# EAGLE design vca (EAGLE 9.5.2)
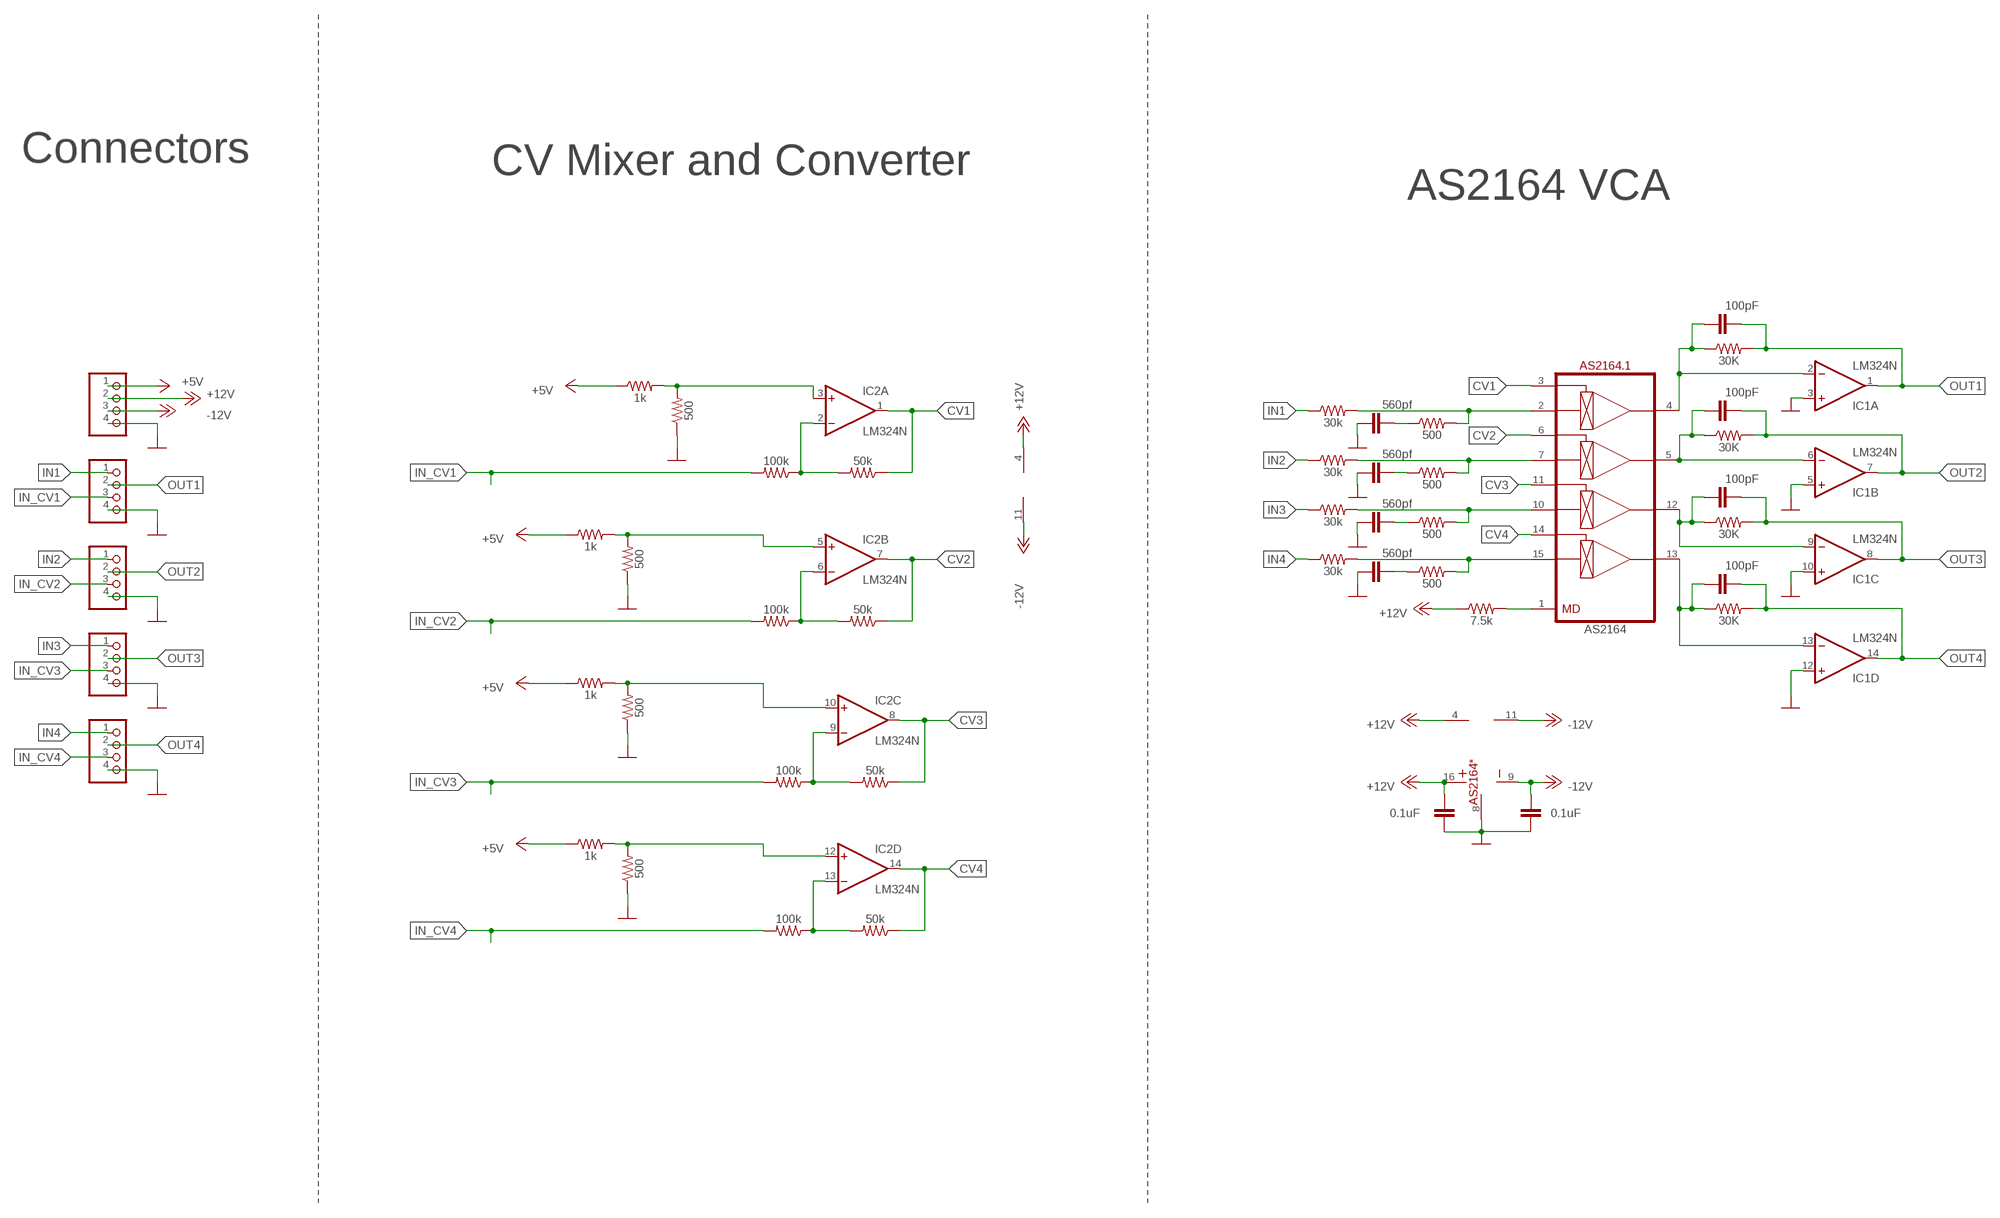
[diagram p0: schematic, sheet 1]

## Parts
AS2164  AS2164  V2164D  [DIP-16]
C1  560pf  0.1UF-KIT-EZ-50V-20%  [CAP-PTH-SMALL-KIT]
C2  560pf  0.1UF-KIT-EZ-50V-20%  [CAP-PTH-SMALL-KIT]
C3  560pf  0.1UF-KIT-EZ-50V-20%  [CAP-PTH-SMALL-KIT]
C4  560pf  0.1UF-KIT-EZ-50V-20%  [CAP-PTH-SMALL-KIT]
C5  0.1uF  0.1UF-KIT-EZ-50V-20%  [CAP-PTH-SMALL-KIT]
C6  0.1uF  0.1UF-KIT-EZ-50V-20%  [CAP-PTH-SMALL-KIT]
C7  100pF  0.1UF-KIT-EZ-50V-20%  [CAP-PTH-SMALL-KIT]
C8  100pF  0.1UF-KIT-EZ-50V-20%  [CAP-PTH-SMALL-KIT]
C9  100pF  0.1UF-KIT-EZ-50V-20%  [CAP-PTH-SMALL-KIT]
C10  100pF  0.1UF-KIT-EZ-50V-20%  [CAP-PTH-SMALL-KIT]
IC1  LM324N  [DIL14]
IC2  LM324N  [DIL14]
JP1  PINHD-1X4  [1X04]
JP5  PINHD-1X4  [1X04]
JP6  PINHD-1X4  [1X04]
JP7  PINHD-1X4  [1X04]
JP8  PINHD-1X4  [1X04]
R1  30k  RESISTORAXIAL-0.3  [AXIAL-0.3]
R2  30k  RESISTORAXIAL-0.3  [AXIAL-0.3]
R3  30k  RESISTORAXIAL-0.3  [AXIAL-0.3]
R4  500  RESISTORAXIAL-0.3  [AXIAL-0.3]
R5  30k  RESISTORAXIAL-0.3  [AXIAL-0.3]
R6  500  RESISTORAXIAL-0.3  [AXIAL-0.3]
R7  500  RESISTORAXIAL-0.3  [AXIAL-0.3]
R8  500  RESISTORAXIAL-0.3  [AXIAL-0.3]
R9  500  RESISTORAXIAL-0.3  [AXIAL-0.3]
R10  1k  RESISTORAXIAL-0.3  [AXIAL-0.3]
R11  100k  RESISTORAXIAL-0.3  [AXIAL-0.3]
R12  50k  RESISTORAXIAL-0.3  [AXIAL-0.3]
R13  1k  RESISTORAXIAL-0.3  [AXIAL-0.3]
R14  500  RESISTORAXIAL-0.3  [AXIAL-0.3]
R15  100k  RESISTORAXIAL-0.3  [AXIAL-0.3]
R16  50k  RESISTORAXIAL-0.3  [AXIAL-0.3]
R17  1k  RESISTORAXIAL-0.3  [AXIAL-0.3]
R18  500  RESISTORAXIAL-0.3  [AXIAL-0.3]
R19  100k  RESISTORAXIAL-0.3  [AXIAL-0.3]
R20  50k  RESISTORAXIAL-0.3  [AXIAL-0.3]
R21  1k  RESISTORAXIAL-0.3  [AXIAL-0.3]
R22  500  RESISTORAXIAL-0.3  [AXIAL-0.3]
R23  100k  RESISTORAXIAL-0.3  [AXIAL-0.3]
R24  50k  RESISTORAXIAL-0.3  [AXIAL-0.3]
R25  7.5k  RESISTORAXIAL-0.3  [AXIAL-0.3]
R26  30K  RESISTORAXIAL-0.3  [AXIAL-0.3]
R27  30K  RESISTORAXIAL-0.3  [AXIAL-0.3]
R28  30K  RESISTORAXIAL-0.3  [AXIAL-0.3]
R29  30K  RESISTORAXIAL-0.3  [AXIAL-0.3]

## Nets
+5V: JP6.1 R10.P$1 R13.P$1 R17.P$1 R21.P$1
+12V: AS2164.16(*:V+) C5.2 IC1.4(P:V+) IC2.4(P:V+) JP6.2 R25.P$1
-12V: AS2164.9(*:V-) C6.2 IC1.11(P:V-) IC2.11(P:V-) JP6.3
CV1: AS2164.3(.1:CV1) IC2.1(A:OUT) R20.P$1
CV2: AS2164.6(.1:CV2) IC2.7(B:OUT) R16.P$1
CV3: AS2164.11(.1:CV3) IC2.8(C:OUT) R12.P$1
CV4: AS2164.14(.1:CV4) IC2.14(D:OUT) R24.P$1
GND: AS2164.8(*:GND) C1.1 C2.1 C3.1 C4.1 C5.1 C6.1 IC1.3(A:+IN) IC1.5(B:+IN) IC1.10(C:+IN) IC1.12(D:+IN) JP1.4 JP5.4 JP6.4 JP7.4 JP8.4 R9.P$1 R14.P$1 R18.P$1 R22.P$1
IN1: JP5.1 R1.P$1
IN2: JP7.1 R2.P$1
IN3: JP1.1 R3.P$1
IN4: JP8.1 R5.P$1
IN_CV1: JP5.3 R19.P$2
IN_CV2: JP7.3 R15.P$2
IN_CV3: JP1.3 R11.P$2
IN_CV4: JP8.3 R23.P$2
N$1: AS2164.2(.1:IN1) R1.P$2 R8.P$2
N$2: AS2164.7(.1:IN2) R2.P$2 R7.P$2
N$3: AS2164.10(.1:IN3) R3.P$2 R6.P$2
N$4: AS2164.15(.1:IN4) R4.P$2 R5.P$2
N$5: C1.2 R8.P$1
N$6: C2.2 R7.P$1
N$7: C3.2 R6.P$1
N$8: C4.2 R4.P$1
N$9: IC2.5(B:+IN) R13.P$2 R14.P$2
N$10: IC2.3(A:+IN) R9.P$2 R10.P$2
N$11: IC2.9(C:-IN) R11.P$1 R12.P$2
N$12: IC2.10(C:+IN) R17.P$2 R18.P$2
N$13: IC2.12(D:+IN) R21.P$2 R22.P$2
N$14: IC2.6(B:-IN) R15.P$1 R16.P$2
N$17: IC2.2(A:-IN) R19.P$1 R20.P$2
N$20: IC2.13(D:-IN) R23.P$1 R24.P$2
N$21: AS2164.1(.1:MD) R25.P$2
N$25: AS2164.13(.1:OUT4) C7.1 IC1.13(D:-IN) R26.P$1
N$31: AS2164.12(.1:OUT3) C8.1 IC1.9(C:-IN) R27.P$1
N$32: AS2164.5(.1:OUT2) C9.1 IC1.6(B:-IN) R28.P$1
N$33: AS2164.4(.1:OUT1) C10.1 IC1.2(A:-IN) R29.P$1
OUT1: C10.2 IC1.1(A:OUT) JP5.2 R29.P$2
OUT2: C9.2 IC1.7(B:OUT) JP7.2 R28.P$2
OUT3: C8.2 IC1.8(C:OUT) JP1.2 R27.P$2
OUT4: C7.2 IC1.14(D:OUT) JP8.2 R26.P$2

## Notes on the sheet
- Connectors | CV Mixer and Converter
- AS2164 VCA

## Library data of the parts
AS2164 = ic-coolaudio:V2164
C1-C4 C7-C10 = SparkFun-RF:0.1UF: 0.1µF ceramic capacitors A capacitor is a passive two-terminal electrical component used to store electrical energy temporarily in an electric field.; PROD_ID: CAP-08370; VALUE: 0.1uF
C5 C6 = SparkFun-RF:0.1UF: 0.1µF ceramic capacitors A capacitor is a passive two-terminal electrical component used to store electrical energy temporarily in an electric field.; PROD_ID: CAP-08370
IC1 IC2 = linear:LM324: OP AMP
JP1 JP5-JP8 = pinhead:PINHD-1X4: PIN HEADER
R1-R29 = SparkFun-Resistors:RESISTOR: Generic Resistor Package

## Board
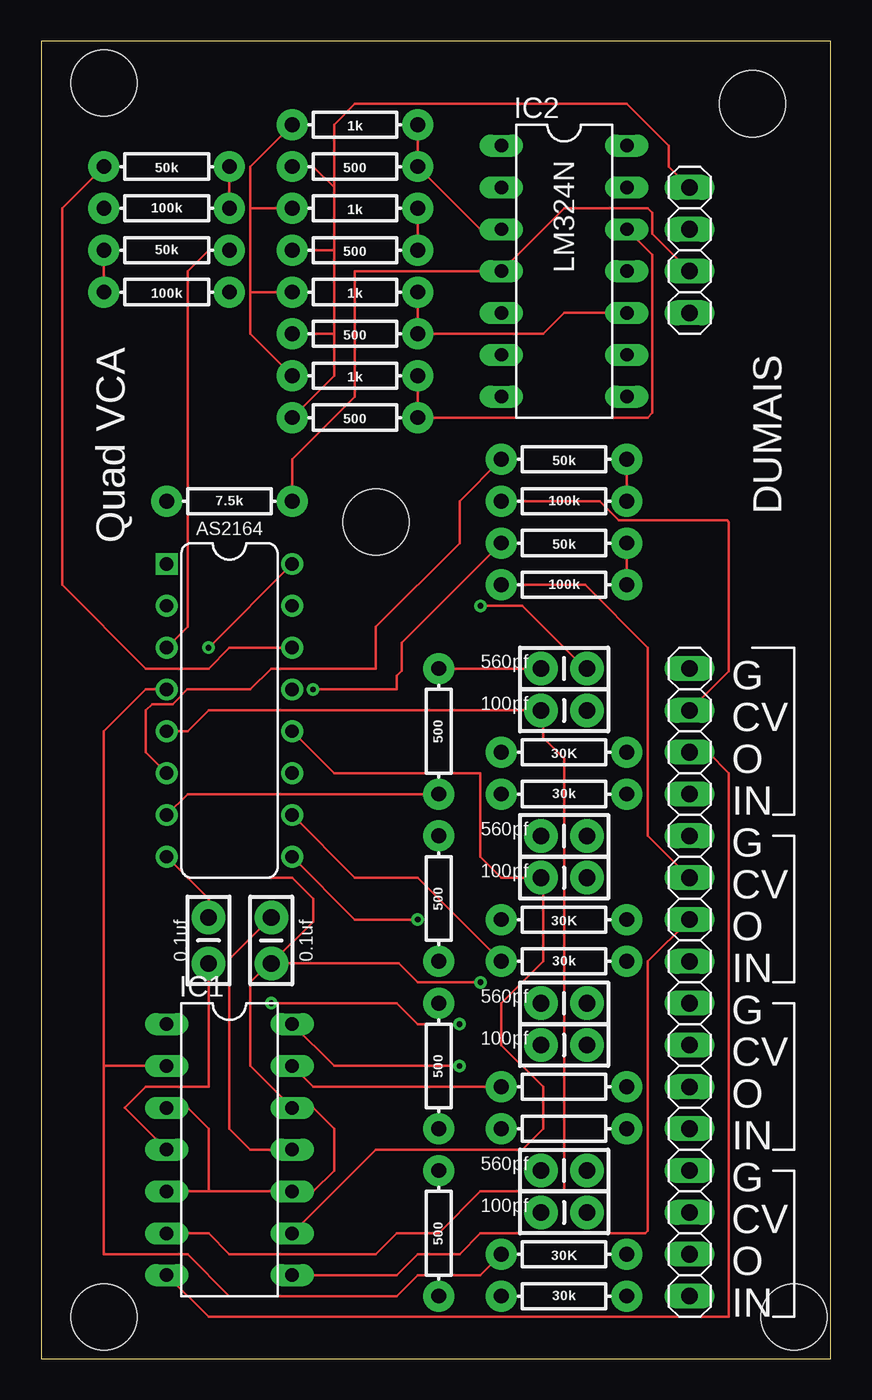
[diagram p1: board, top side]
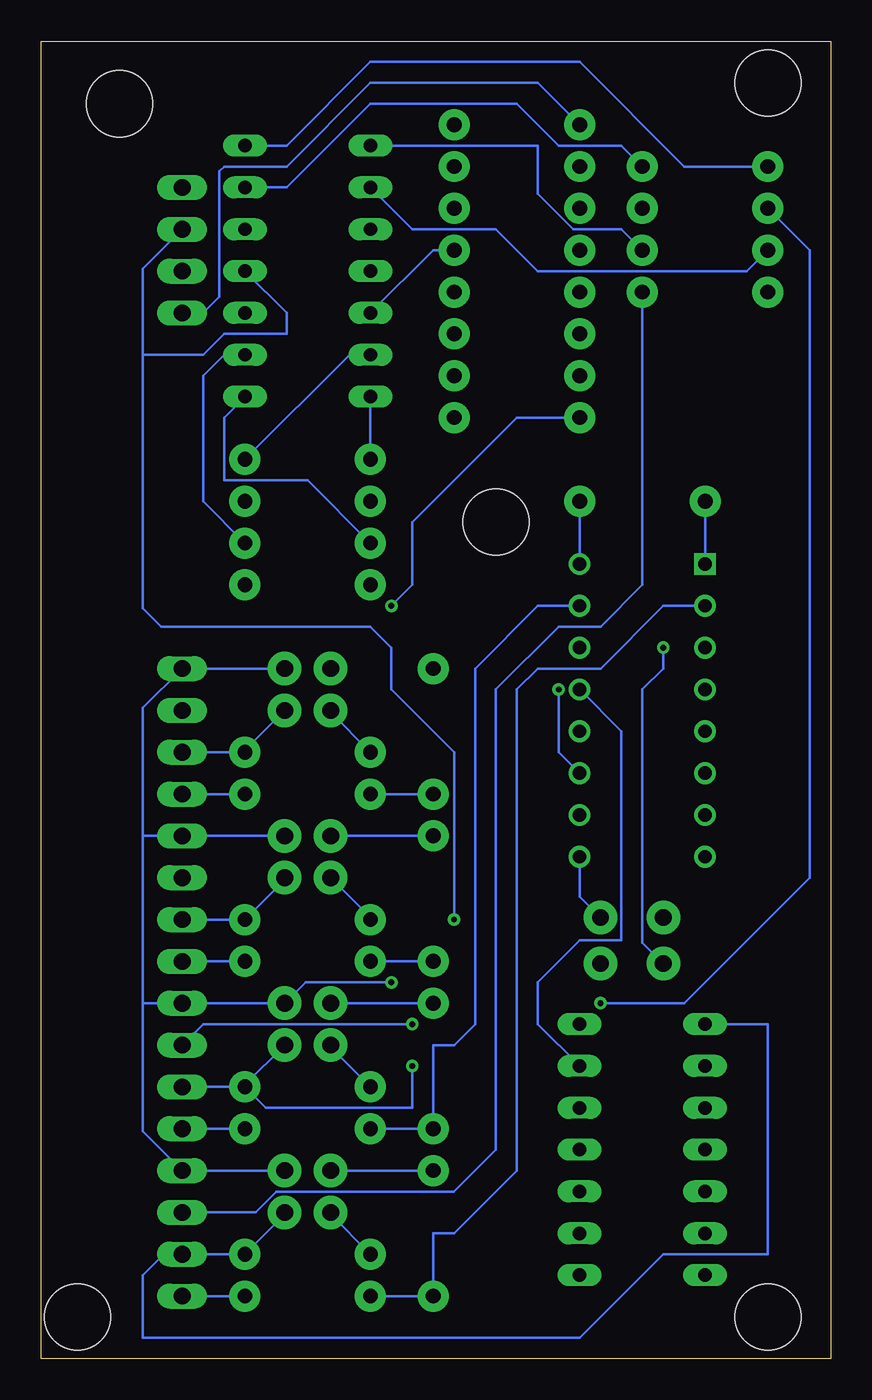
[diagram p2: board, bottom side, seen from below]

Size 47.93 x 80 mm. Coordinates in mm from the lower left corner, seen from the top.
Outline: 0,0 47.93,0 47.93,80 0,80 0,0
Copper layers (1*16): Top 0.035mm / dielectric 1.5mm / Bottom 0.035mm
Design rules "default": minimum track width 6mil, minimum drill 0.35mm, track to track 6mil, track to pad 6mil, pad to pad 6mil, via to via 6mil, smd to smd 6mil, copper to edge 40mil, drill to drill 6mil, minimum pad ring 10mil, minimum via ring 8mil, stop-mask expansion 4mil, vias tented up to drill 0mil, thermal gap 10mil
Holes 4 mm at 20.32,50.8 3.81,77.47 43.18,76.2 3.81,2.54 45.72,2.54

### Footprints (pad centres in the part's own frame; a part is rotated, then mirrored left to right if it is on the bottom)
DIP-16 = drill 0.813 square: 1 -8.89,-3.81 | drill 0.813: 2 -6.35,-3.81; 3 -3.81,-3.81; 4 -1.27,-3.81; 5 1.27,-3.81; 6 3.81,-3.81; 7 6.35,-3.81; 8 8.89,-3.81; 9 8.89,3.81; 10 6.35,3.81; 11 3.81,3.81; 12 1.27,3.81; 13 -1.27,3.81; 14 -3.81,3.81; 15 -6.35,3.81; 16 -8.89,3.81
CAP-PTH-SMALL-KIT = drill 1.016 pad 2.032: 1 -1.397,0; 2 1.397,0
DIL14 = drill 0.813 long: 1 -7.62,-3.81; 2 -5.08,-3.81; 3 -2.54,-3.81; 4 0,-3.81; 5 2.54,-3.81; 6 5.08,-3.81; 7 7.62,-3.81; 8 7.62,3.81; 9 5.08,3.81; 10 2.54,3.81; 11 0,3.81; 12 -2.54,3.81; 13 -5.08,3.81; 14 -7.62,3.81
1X04 = drill 1.016 long: 1 -3.81,0; 2 -1.27,0; 3 1.27,0; 4 3.81,0
AXIAL-0.3 = drill 0.9 pad 1.88: P$1 -3.81,0; P$2 3.81,0

### Placement (x,y rotation side)
AS2164  11.43,39.37 270 top
C1  31.75,11.43 180 top
C2  31.75,41.91 180 top
C3  31.75,31.75 180 top
C4  31.75,21.59 180 top
C5  10.16,25.4 270 top
C6  13.97,25.4 90 top
C7  31.75,19.05 0 top
C8  31.75,29.21 0 top
C9  31.75,39.37 0 top
C10  31.75,8.89 0 top
IC1  11.43,12.7 270 top
IC2  31.75,66.04 270 top
JP1  39.37,27.94 90 top
JP5  39.37,7.62 90 top
JP6  39.37,67.31 90 top
JP7  39.37,38.1 90 top
JP8  39.37,17.78 90 top
R1  31.75,3.81 180 top
R2  31.75,34.29 180 top
R3  31.75,24.13 180 top
R4  24.13,17.78 270 top
R5  31.75,13.97 180 top
R6  24.13,27.94 270 top
R7  24.13,38.1 270 top
R8  24.13,7.62 270 top
R9  19.05,72.39 0 top
R10  19.05,74.93 0 top
R11  31.75,46.99 180 top
R12  31.75,49.53 0 top
R13  19.05,69.85 0 top
R14  19.05,67.31 0 top
R15  31.75,52.07 180 top
R16  31.75,54.61 0 top
R17  19.05,64.77 0 top
R18  19.05,62.23 0 top
R19  7.62,64.77 0 top
R20  7.62,67.31 180 top
R21  19.05,59.69 0 top
R22  19.05,57.15 0 top
R23  7.62,69.85 180 top
R24  7.62,72.39 0 top
R25  11.43,52.07 180 top
R26  31.75,16.51 0 top
R27  31.75,26.67 0 top
R28  31.75,36.83 0 top
R29  31.75,6.35 0 top

### Tracks (layer width: path | path; a pad name or v marks a point on that pad's centre or on a via)
+5V
  Top 0.152: 12.7,64.77 12.7,62.23 R21.P$1 | 12.7,64.77 12.7,69.85 | 12.7,69.85 12.7,72.39 R10.P$1 | R13.P$1 12.7,69.85 | R17.P$1 12.7,64.77
  Bottom 0.152: R10.P$1 17.78,77.47 27.94,77.47 33.02,72.39 36.83,72.39 37.11,72.11 37.11,64.49 38.1,63.5 JP6.1
+12V  (via drill 0.35)
  Top 0.152: IC1.4 5.08,15.24 6.35,16.51 10.16,16.51 C5.2 | AS2164.16 v10.16,43.18 | R25.P$1 15.24,54.61 19.05,58.42 19.05,66.04 IC2.4 31.75,69.85 36.83,69.85 37.11,69.57 37.11,68.3 JP6.2
  Bottom 0.152: AS2164.16 R25.P$1 | v10.16,43.18 10.16,41.91 11.43,40.64 11.43,25.27 C5.2
-12V  (via drill 0.35)
  Top 0.152: IC1.11 12.7,12.7 11.43,13.97 11.43,24.26 C6.2 | v22.86,26.67 19.05,26.67 AS2164.9
  Bottom 0.152: JP6.3 41.76,66.19 41.76,60.96 | C6.2 15.24,28.07 AS2164.9 | v22.86,26.67 22.86,36.83 26.67,40.64 26.67,43.18 27.94,44.45 40.64,44.45 41.76,45.57 41.76,60.96 | IC2.11 33.02,63.5 33.02,62.23 36.83,62.23 38.1,60.96 41.76,60.96
CV1
  Top 0.152: R20.P$1 10.16,67.31 8.89,66.04 8.89,44.45 AS2164.3
  Bottom 0.152: IC2.1 17.78,73.66 17.78,70.74 15.62,68.58 12.7,68.58 R20.P$1
CV2
  Top 0.152: AS2164.6 6.35,36.83 6.35,39.37 6.73,39.75 7.99,39.75 8.88,40.64 12.7,40.64 13.97,41.91 20.32,41.91 20.32,44.45 25.4,49.53 25.4,52.07 R16.P$1
  Bottom 0.152: R16.P$1 IC2.7
CV3  (via drill 0.35)
  Top 0.152: v16.51,40.64 21.59,40.64 21.59,41.48 21.89,41.78 21.89,43.48 R12.P$1
  Bottom 0.152: R12.P$1 31.75,53.34 36.83,53.34 36.83,57.15 IC2.8 | AS2164.11 16.51,36.83 v16.51,40.64
CV4
  Top 0.152: AS2164.14 11.43,43.18 10.16,41.91 6.35,41.91 1.27,46.99 1.27,69.85 R24.P$1
  Bottom 0.152: IC2.14 33.02,73.66 27.94,78.74 15.24,78.74 8.89,72.39 R24.P$1
GND  (via drill 0.35)
  Top 0.152: R22.P$1 17.78,59.69 17.78,62.23 | 17.78,62.23 17.78,67.31 | 17.78,67.31 17.78,71.12 | 17.78,71.12 16.51,72.39 R9.P$1 | 17.78,67.31 R14.P$1 | 17.78,62.23 R18.P$1 | 17.78,71.12 17.78,74.93 19.05,76.2 35.56,76.2 38.1,73.66 38.1,72.39 JP6.4 | 10.16,10.16 IC1.10 16.51,10.16 17.78,11.43 17.78,13.97 16.51,15.24 IC1.12 12.7,17.78 12.7,22.86 13.84,24 C6.1 | 10.16,10.16 IC1.5 | IC1.3 8.89,15.24 10.16,13.97 10.16,10.16 | C5.1 10.16,27.94 AS2164.8 8.89,29.21 15.24,29.21 16.51,27.94 16.51,26.54 C6.1 | C6.1 21.72,24 22.86,22.86 v26.67,22.86 | v26.67,45.72 29.21,45.72 33.02,41.91 C2.1
  Bottom 0.152: 41.76,21.59 41.76,13.82 JP5.4 C1.1 | 41.76,21.59 41.76,31.75 | 41.76,31.75 41.76,39.52 JP7.4 C2.1 | C3.1 JP1.4 41.76,31.75 | v26.67,22.86 31.88,22.86 C4.1 JP8.4 41.76,21.59 | R22.P$1 19.05,57.15 25.4,50.8 25.4,46.99 v26.67,45.72
IN1
  Bottom 0.152: JP5.1 R1.P$1
IN2
  Bottom 0.152: JP7.1 R2.P$1
IN3
  Bottom 0.152: JP1.1 R3.P$1
IN4
  Bottom 0.152: JP8.1 R5.P$1
IN_CV1
  Bottom 0.152: JP5.3 34.91,8.89 33.66,10.13 22.89,10.13 20.32,12.7 20.32,40.64 16.51,44.45 13.97,44.45 11.43,46.99 R19.P$2
IN_CV2
  Top 0.152: JP7.3 41.76,41.76 41.76,50.8 41.66,50.9 35.08,50.9 33.91,52.07 R15.P$2
IN_CV3
  Top 0.152: R11.P$2 33.02,46.99 36.83,43.18 36.83,31.75 JP1.3
IN_CV4  (via drill 0.35)
  Top 0.152: v25.4,20.32 22.86,20.32 21.59,21.59 v13.97,21.59
  Bottom 0.152: R23.P$2 1.27,67.31 1.27,29.21 8.89,21.59 v13.97,21.59 | JP8.3 38.1,20.32 v25.4,20.32
N$1
  Bottom 0.152: R1.P$2 R8.P$2 24.13,7.62 22.86,7.62 19.05,11.43 19.05,40.64 17.78,41.91 13.97,41.91 10.16,45.72 AS2164.2
N$2
  Top 0.152: AS2164.7 8.89,34.29 R7.P$2
  Bottom 0.152: R7.P$2 R2.P$2
N$3
  Top 0.152: AS2164.10 19.05,29.21 22.86,29.21 R3.P$2
  Bottom 0.152: R6.P$2 R3.P$2
N$4
  Bottom 0.152: R5.P$2 R4.P$2 24.13,19.05 22.86,19.05 21.59,20.32 21.59,41.91 17.78,45.72 AS2164.15
N$5
  Bottom 0.152: R8.P$1 C1.2
N$6
  Top 0.152: R7.P$1 C2.2
N$7
  Bottom 0.152: R6.P$1 C3.2
N$8
  Bottom 0.152: R4.P$1 C4.2
N$9
  Top 0.152: R13.P$2 R14.P$2
  Bottom 0.152: R14.P$2 24.13,67.31 IC2.5
N$10
  Top 0.152: R10.P$2 R9.P$2 26.67,68.58 IC2.3
N$11
  Top 0.152: R12.P$2 R11.P$1
  Bottom 0.152: R12.P$2 38.1,52.07 38.1,59.69 36.83,60.96 IC2.9
N$12
  Top 0.152: R17.P$2 R18.P$2 30.48,62.23 31.75,63.5 IC2.10
N$13
  Top 0.152: R21.P$2 R22.P$2 36.83,57.15 37.11,57.43 37.11,67.03 IC2.12
N$14
  Top 0.152: R16.P$2 R15.P$1
  Bottom 0.152: R16.P$2 29.21,60.96 IC2.6
N$17
  Top 0.152: R20.P$2 R19.P$1
  Bottom 0.152: IC2.2 25.4,68.58 20.32,68.58 17.78,66.04 5.08,66.04 R20.P$2
N$20
  Top 0.152: R24.P$2 R23.P$1
  Bottom 0.152: IC2.13 33.02,71.12 27.94,76.2 19.05,76.2 16.51,73.66 12.7,73.66 R24.P$2
N$21
  Bottom 0.152: R25.P$2 AS2164.1
N$25
  Top 0.152: R26.P$1 16.51,16.51 IC1.13
  Bottom 0.152: C7.1 30.35,18.92 R26.P$1 | AS2164.13 12.7,38.1 12.7,25.4 15.24,25.4 17.78,22.86 17.78,20.32 IC1.13
N$31
  Top 0.152: AS2164.12 17.78,35.56 26.67,35.56 26.67,30.48 27.94,29.21 C8.1 30.48,29.08 30.48,24.13 27.94,21.59 27.94,19.05 30.48,16.51 30.48,13.97 29.21,12.7 20.32,12.7 IC1.9
  Bottom 0.152: C8.1 27.94,26.8 R27.P$1
N$32
  Top 0.152: AS2164.5 8.89,38.1 10.16,39.37 C9.1 30.48,39.37 30.48,37.72 31.75,36.45 31.75,10.16 26.67,10.16 24.13,7.62 21.59,7.62 20.32,6.35 11.43,6.35 10.16,7.62 IC1.6
  Bottom 0.152: C9.1 30.35,39.24 R28.P$1
N$33
  Top 0.152: R29.P$1 26.67,5.08 22.86,5.08 21.59,3.81 11.43,3.81 8.89,6.35 3.81,6.35 3.81,17.78 | 3.81,17.78 IC1.2 | AS2164.4 6.35,40.64 3.81,38.1 3.81,17.78
  Bottom 0.152: C10.1 30.35,8.76 R29.P$1
OUT1
  Bottom 0.152: C10.2 33.15,8.76 R29.P$2 JP5.2 40.49,6.35 41.76,5.08 41.76,1.27 15.24,1.27 10.16,6.35 3.81,6.35 3.81,20.32 IC1.1
OUT2
  Top 0.152: IC1.7 10.16,2.54 41.76,2.54 41.76,35.56 40.49,36.83 JP7.2
  Bottom 0.152: C9.2 35.56,36.96 R28.P$2 JP7.2
OUT3
  Top 0.152: IC1.8 21.59,5.08 22.86,6.35 25.4,6.35 26.67,7.62 36.68,7.62 36.83,7.77 36.83,24.13 JP1.2
  Bottom 0.152: C8.2 33.15,29.08 R27.P$2 JP1.2
OUT4  (via drill 0.35)
  Top 0.152: IC1.14 17.78,17.78 v25.4,17.78
  Bottom 0.152: C7.2 35.56,16.64 R26.P$2 | R26.P$2 JP8.2 | v25.4,17.78 25.4,15.24 34.29,15.24 R26.P$2

### Text on the board
tPlace: DUMAIS | Quad VCA | 560pf | G | 100pf | CV | O | IN | 560pf | G | 100pf | CV | O | 0.1uf | 0.1uf | IN | 560pf | G | 100pf | CV | O | IN | 560pf | G | 100pf | CV | O | IN
tValues: G | -12 | +12 | +5